# EAGLE design 4x4-keyboard (EAGLE 6.6.0)
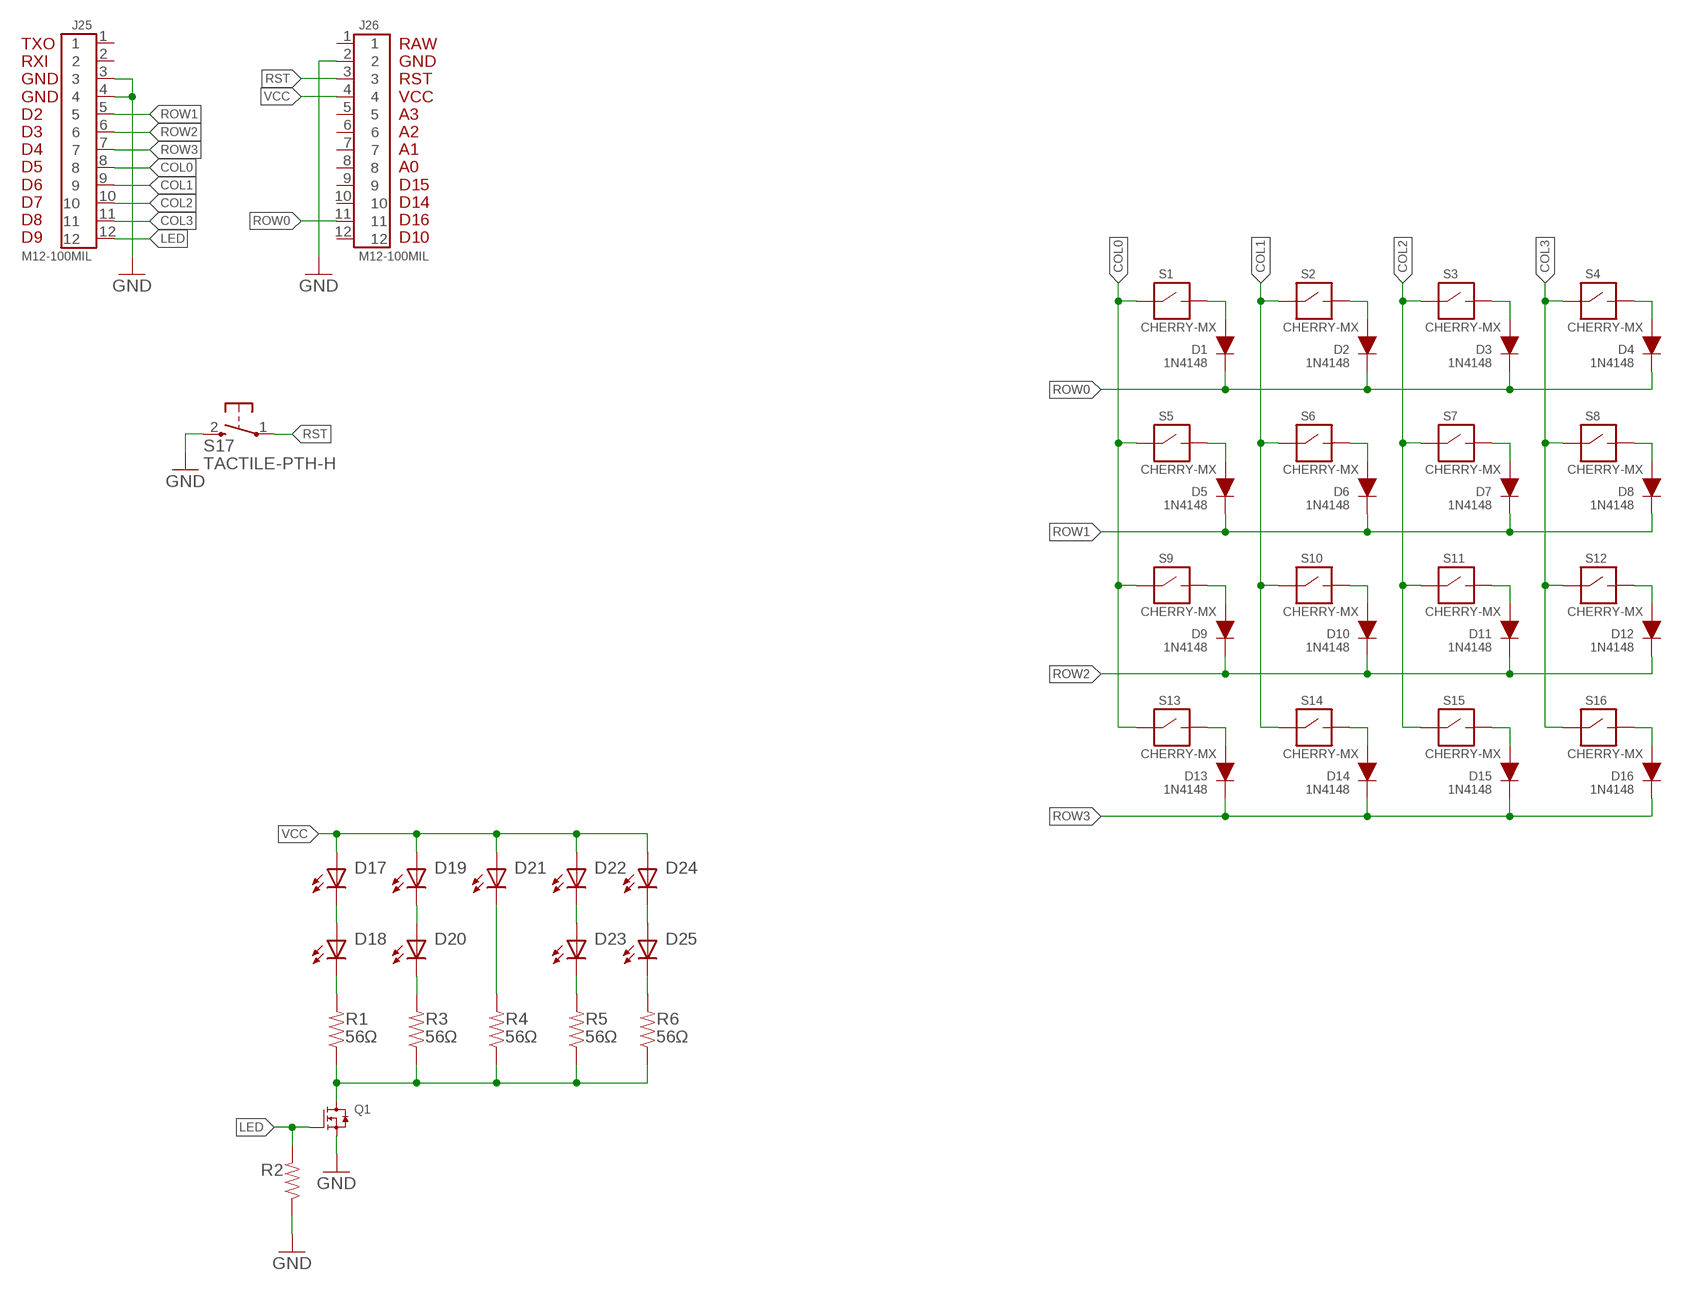
[diagram p0: schematic, sheet 1]

## Parts
D1  1N4148  DIODE-PTH  [DIODE-PTH]
D2  1N4148  DIODE-PTH  [DIODE-PTH]
D3  1N4148  DIODE-PTH  [DIODE-PTH]
D4  1N4148  DIODE-PTH  [DIODE-PTH]
D5  1N4148  DIODE-PTH  [DIODE-PTH]
D6  1N4148  DIODE-PTH  [DIODE-PTH]
D7  1N4148  DIODE-PTH  [DIODE-PTH]
D8  1N4148  DIODE-PTH  [DIODE-PTH]
D9  1N4148  DIODE-PTH  [DIODE-PTH]
D10  1N4148  DIODE-PTH  [DIODE-PTH]
D11  1N4148  DIODE-PTH  [DIODE-PTH]
D12  1N4148  DIODE-PTH  [DIODE-PTH]
D13  1N4148  DIODE-PTH  [DIODE-PTH]
D14  1N4148  DIODE-PTH  [DIODE-PTH]
D15  1N4148  DIODE-PTH  [DIODE-PTH]
D16  1N4148  DIODE-PTH  [DIODE-PTH]
D17  LED-3MM  [3MM-LED]
D18  LED-3MM  [3MM-LED]
D19  LED-3MM  [3MM-LED]
D20  LED-3MM  [3MM-LED]
D21  LED-3MM  [3MM-LED]
D22  LED-3MM  [3MM-LED]
D23  LED-3MM  [3MM-LED]
D24  LED-3MM  [3MM-LED]
D25  LED-3MM  [3MM-LED]
J25  M12-100MIL  [M12X1]
J26  M12-100MIL  [M12X1]
Q1  N-MOSFET-TO-92  [TO-92-3]
R1  56Ω  RESISTOR-PTH  [RESISTOR-PTH]
R2  RESISTOR-PTH  [RESISTOR-PTH]
R3  56Ω  RESISTOR-PTH  [RESISTOR-PTH]
R4  56Ω  RESISTOR-PTH  [RESISTOR-PTH]
R5  56Ω  RESISTOR-PTH  [RESISTOR-PTH]
R6  56Ω  RESISTOR-PTH  [RESISTOR-PTH]
S1  CHERRY-MX  [CHERRY-MX]
S2  CHERRY-MX  [CHERRY-MX]
S3  CHERRY-MX  [CHERRY-MX]
S4  CHERRY-MX  [CHERRY-MX]
S5  CHERRY-MX  [CHERRY-MX]
S6  CHERRY-MX  [CHERRY-MX]
S7  CHERRY-MX  [CHERRY-MX]
S8  CHERRY-MX  [CHERRY-MX]
S9  CHERRY-MX  [CHERRY-MX]
S10  CHERRY-MX  [CHERRY-MX]
S11  CHERRY-MX  [CHERRY-MX]
S12  CHERRY-MX  [CHERRY-MX]
S13  CHERRY-MX  [CHERRY-MX]
S14  CHERRY-MX  [CHERRY-MX]
S15  CHERRY-MX  [CHERRY-MX]
S16  CHERRY-MX  [CHERRY-MX]
S17  TACTILE-PTH-H  [TACTILE-HORIZONTAL]

## Nets
COL0: J25.8 S1.S1 S1.S4(S1) S5.S1 S5.S4(S1) S9.S1 S9.S4(S1) S13.S1 S13.S4(S1)
COL1: J25.9 S2.S1 S2.S4(S1) S6.S1 S6.S4(S1) S10.S1 S10.S4(S1) S14.S1 S14.S4(S1)
COL2: J25.10 S3.S1 S3.S4(S1) S7.S1 S7.S4(S1) S11.S1 S11.S4(S1) S15.S1 S15.S4(S1)
COL3: J25.11 S4.S1 S4.S4(S1) S8.S1 S8.S4(S1) S12.S1 S12.S4(S1) S16.S1 S16.S4(S1)
GND: J25.3 J25.4 J26.2 Q1.1(SOURCE) R2.P$1 S17.2
LED: J25.12 Q1.2(GATE) R2.P$2
N$2: D3.A S3.S2 S3.S3(S2)
N$3: D4.A S4.S2 S4.S3(S2)
N$4: D2.A S2.S2 S2.S3(S2)
N$5: D1.A S1.S2 S1.S3(S2)
N$6: Q1.3(DRAIN) R1.P$1 R3.P$1 R4.P$1 R5.P$1 R6.P$1
N$9: D9.A S9.S2 S9.S3(S2)
N$10: D10.A S10.S2 S10.S3(S2)
N$11: D11.A S11.S2 S11.S3(S2)
N$12: D12.A S12.S2 S12.S3(S2)
N$13: D16.A S16.S2 S16.S3(S2)
N$14: D15.A S15.S2 S15.S3(S2)
N$15: D14.A S14.S2 S14.S3(S2)
N$16: D13.A S13.S2 S13.S3(S2)
N$17: D5.A S5.S2 S5.S3(S2)
N$18: D6.A S6.S2 S6.S3(S2)
N$19: D7.A S7.S2 S7.S3(S2)
N$20: D8.A S8.S2 S8.S3(S2)
N$22: D21.C R4.P$2
N$23: D24.C D25.A
N$24: D22.C D23.A
N$25: D23.C R5.P$2
N$28: D25.C R6.P$2
N$34: D19.C D20.A
N$35: D20.C R3.P$2
N$36: D18.C R1.P$2
N$37: D17.C D18.A
ROW0: D1.C D2.C D3.C D4.C J26.11
ROW1: D5.C D6.C D7.C D8.C J25.5
ROW2: D9.C D10.C D11.C D12.C J25.6
ROW3: D13.C D14.C D15.C D16.C J25.7
RST: J26.3 S17.1
VCC: D17.A D19.A D21.A D22.A D24.A J26.4
Unconnected: J25.1 J25.2 J26.1 J26.5 J26.6 J26.7 J26.8 J26.9 J26.10 J26.12

## Notes on the sheet
- TXO
  RXI
  GND
  GND
  D2
  D3
  D4
  D5
  D6
  D7
  D8
  D9
- RAW
  GND
  RST
  VCC
  A3
  A2
  A1
  A0
  D15
  D14
  D16
  D10

## Library data of the parts
D1-D16 = Passives:DIODE
D17-D25 = Passives:LED
J25 J26 = Connectors:M12
Q1 = Passives:N-MOSFET
R1-R6 = Passives:RESISTOR
S1-S16 = Cherry-MX:CHERRY-MX
S17 = Passives:TACTILE

## Board
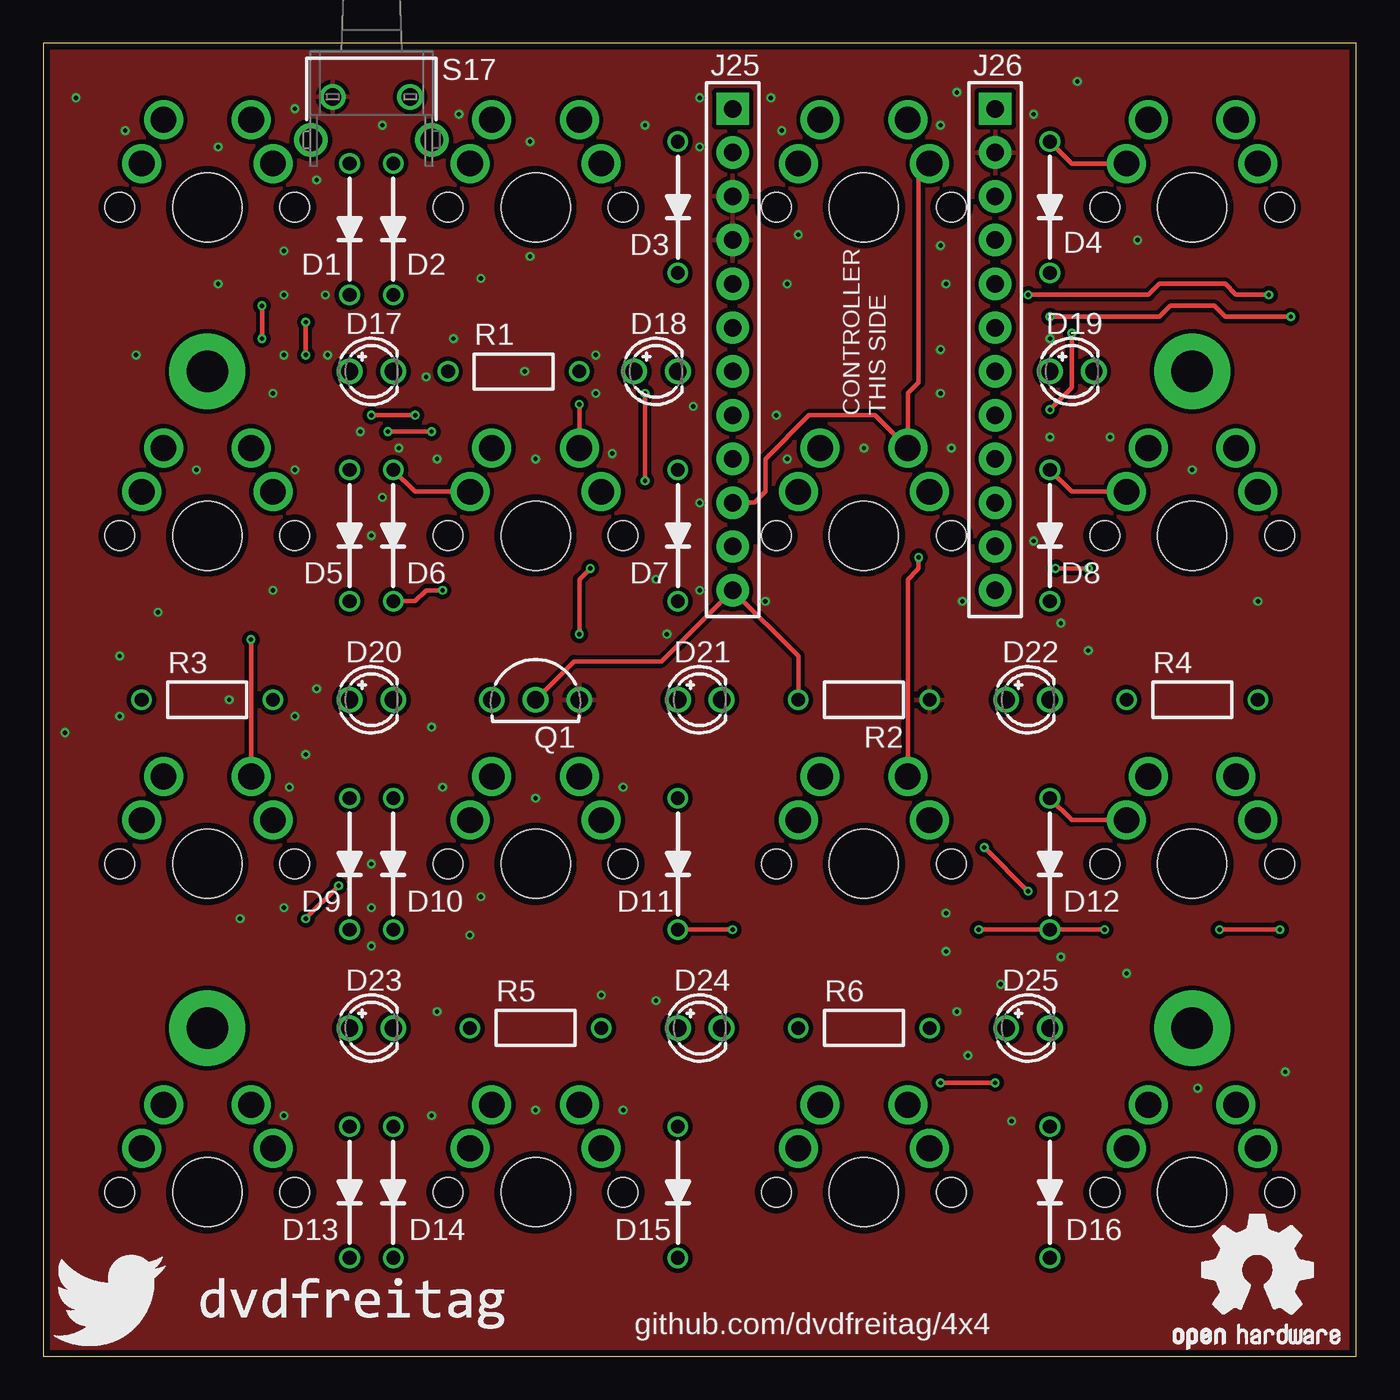
[diagram p1: board, top side]
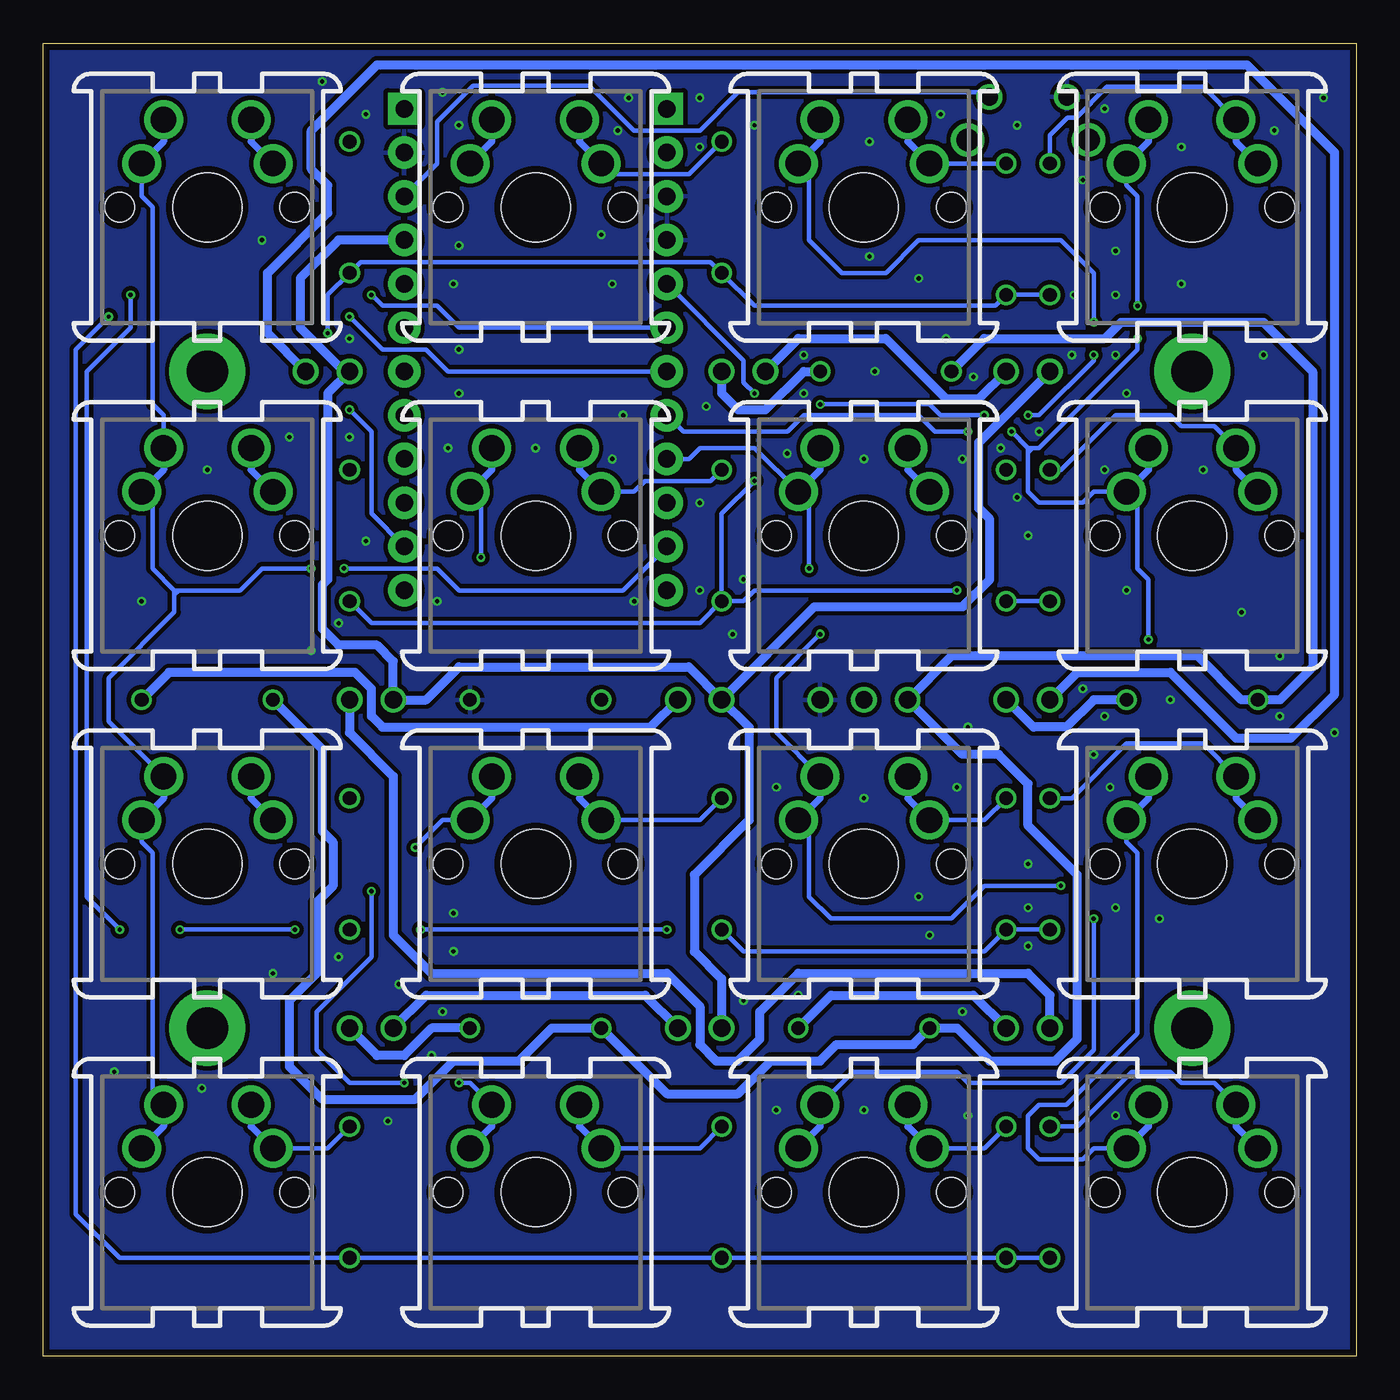
[diagram p2: board, bottom side, seen from below]

Size 76.2 x 76.2 mm. Coordinates in mm from the lower left corner, seen from the top.
Outline: 0,0 76.2,0 76.2,76.2 0,76.2 0,0
Copper layers (1*16): Top 0.035559375mm / dielectric 1.6mm / Bottom 0.035559375mm
Design rules "default *": minimum track width 6mil, minimum drill 10mil, track to track 6mil, track to pad 6mil, pad to pad 6mil, via to via 6mil, smd to smd 6mil, copper to edge 15mil, drill to drill 6mil, minimum pad ring 5mil, minimum via ring 5mil, stop-mask expansion 2.5mil, vias tented up to drill 20mil, thermal gap 10mil

### Footprints (pad centres in the part's own frame; a part is rotated, then mirrored left to right if it is on the bottom)
DIODE-PTH = drill 0.8: A -3.81,0; C 3.81,0
3MM-LED = drill 1: A -1.27,0; C 1.27,0
M12X1 = drill 1.016 pad 1.88 square: 1 0,0 | drill 1.016 pad 1.88: 2 2.54,0; 3 5.08,0; 4 7.62,0; 5 10.16,0; 6 12.7,0; 7 15.24,0; 8 17.78,0; 9 20.32,0; 10 22.86,0; 11 25.4,0; 12 27.94,0
TO-92-3 = drill 1: 1 -2.54,0; 2 0,0; 3 2.54,0
RESISTOR-PTH = drill 0.8: P$1 -3.81,0; P$2 3.81,0
CHERRY-MX = drill 1.499 pad 2.261: S1 -3.81,2.54; S2 2.54,5.08; S3 3.81,2.54; S4 -2.54,5.08 | hole 3.988: 0,0 | hole 1.702: -5.08,0; 5.08,0
TACTILE-HORIZONTAL = drill 0.991: 1 2.616,2.248; 2 2.616,-2.248 | drill 1.295: P$3 5.105,3.505; P$4 5.105,-3.505

### Placement (x,y rotation side)
D1  17.78,65.41 270 top
D2  20.32,65.41 270 top
D3  36.83,66.67 270 top
D4  58.42,66.67 270 top
D5  17.78,47.62 270 top
D6  20.32,47.62 270 top
D7  36.83,47.62 270 top
D8  58.42,47.62 270 top
D9  17.78,28.57 270 top
D10  20.32,28.57 270 top
D11  36.83,28.57 270 top
D12  58.42,28.57 270 top
D13  17.78,9.53 270 top
D14  20.32,9.53 270 top
D15  36.83,9.53 270 top
D16  58.42,9.53 270 top
D17  19.05,57.15 0 top
D18  35.56,57.15 0 top
D19  59.69,57.15 0 top
D20  19.05,38.1 0 top
D21  38.1,38.1 0 top
D22  57.15,38.1 0 top
D23  19.05,19.05 0 top
D24  38.1,19.05 0 top
D25  57.15,19.05 0 top
J25  40.01,72.39 270 top
J26  55.24,72.39 270 top
Q1  28.57,38.1 180 top
R1  27.3,57.15 0 top
R2  47.62,38.1 180 top
R3  9.53,38.1 0 top
R4  66.67,38.1 0 top
R5  28.57,19.05 0 top
R6  47.62,19.05 0 top
S1  9.53,66.67 0 bottom
S2  28.57,66.67 0 bottom
S3  47.62,66.67 0 bottom
S4  66.67,66.67 0 bottom
S5  9.53,47.62 0 bottom
S6  28.57,47.62 0 bottom
S7  47.62,47.62 0 bottom
S8  66.67,47.62 0 bottom
S9  9.53,28.57 0 bottom
S10  28.57,28.57 0 bottom
S11  47.62,28.57 0 bottom
S12  66.67,28.57 0 bottom
S13  9.53,9.53 0 bottom
S14  28.57,9.53 0 bottom
S15  47.62,9.53 0 bottom
S16  66.67,9.53 0 bottom
S17  19.05,75.69 270 top
U$1  [TWITTER]  0.64,0 0 top
U$2  [OSHW]  65.53,0.25 0 top

### Tracks (layer width: path | path; a pad name or v marks a point on that pad's centre or on a via)
COL0  (via drill 0.25)
  Top 0.254: v22.54,53.66 v20,53.66 | S9.S4 v12.06,41.59 | v12.7,60.96 v12.7,59.05
  Bottom 0.254: J25.8 39.05,53.66 33.02,53.66 32.07,54.61 25.4,54.61 24.45,53.66 v22.54,53.66 | v20,53.66 19.05,52.7 | 19.05,52.7 19.05,52.45 | 19.05,52.45 19.05,50.16 18.41,49.53 15.88,49.53 15.24,50.16 S5.S1 12.7,49.53 12.7,45.72 12.06,45.09 v12.06,41.59 | S9.S1 13.34,29.84 12.7,29.21 12.7,18.73 16.83,14.61 18.41,14.61 19.05,13.97 19.05,12.06 18.41,11.43 15.88,11.43 15.24,12.06 S13.S1 | S1.S1 13.34,67.94 12.7,67.31 v12.7,60.96 | v12.7,59.05 12.7,58.42 18.41,52.7 18.8,52.7 | 18.8,52.7 19.05,52.7 | 18.8,52.7 19.05,52.45
  Bottom 0.406: S1.S4 12.06,70.48 S1.S1 | S5.S4 12.06,51.44 S5.S1 | S9.S4 12.06,32.38 S9.S1 | S13.S4 12.06,13.34 S13.S1
COL1  (via drill 0.25)
  Top 0.254: v15.24,25.4 v17.14,27.3 | v31.11,41.91 31.11,45.09 v31.75,45.72 | S6.S4 v31.11,55.24 | v21.59,54.61 v19.05,54.61 | v15.24,58.1 v15.24,60.01
  Bottom 0.254: J25.9 38.73,52.07 38.1,52.7 34.92,52.7 S6.S1 31.75,49.53 v31.75,45.72 | v17.14,27.3 21.59,27.3 23.5,25.4 30.48,25.4 31.75,26.67 31.75,30.48 S10.S1 | v31.11,55.24 24.77,55.24 24.13,54.61 v21.59,54.61 | v19.05,54.61 18.41,54.61 15.24,57.78 v15.24,58.1 | v15.24,60.01 15.24,62.87 17.14,64.77 25.4,64.77 27.3,62.87 29.84,62.87 31.75,64.77 31.75,68.58 S2.S1 | S10.S4 33.66,36.2 33.66,39.37 v31.11,41.91 | S14.S4 29.21,16.51 23.18,16.51 22.54,15.88 17.14,15.88 15.24,17.78 v15.24,25.4
  Bottom 0.406: S2.S4 31.11,70.48 S2.S1 | S6.S4 31.11,51.44 S6.S1 | S10.S4 31.11,32.38 S10.S1 | S14.S4 31.11,13.34 S14.S1
COL2  (via drill 0.25)
  Top 0.254: J25.10 41.27,49.53 41.91,50.16 41.91,52.07 44.45,54.61 48.26,54.61 S7.S4 50.16,55.88 50.8,56.52 50.8,68.58 S3.S1 | v54.61,29.53 v57.15,26.99 | v55.24,15.88 v52.07,15.88 | S11.S4 50.16,45.09 50.8,45.72 v50.8,46.35
  Bottom 0.254: S11.S1 53.02,31.11 v54.61,29.53 | v57.15,26.99 57.15,23.18 60.33,20 60.33,17.78 58.42,15.88 v55.24,15.88 | v52.07,15.88 51.44,15.88 S15.S4 | v50.8,46.35 50.8,49.53 S7.S1
  Bottom 0.406: S7.S4 50.16,51.44 S7.S1 | S3.S4 50.16,70.48 S3.S1 | S11.S4 50.16,32.38 S11.S1 | S15.S4 50.16,13.34 S15.S1
COL3  (via drill 0.25)
  Top 0.254: v58.74,45.72 v60.64,45.72
  Bottom 0.254: S4.S1 70.48,67.31 69.85,66.67 69.85,55.24 69.22,54.61 S8.S4 | J25.11 42.55,44.45 52.07,44.45 53.34,45.72 v58.74,45.72 | v60.64,45.72 63.5,45.72 64.77,44.45 68.33,44.45 | 68.33,44.45 68.58,44.45 | 68.58,44.45 69.85,45.72 69.85,49.53 S8.S1 | 68.58,44.45 68.58,44.2 | S12.S1 70.48,29.84 69.85,29.21 69.85,15.24 S16.S4 | 68.33,44.45 68.58,44.2 | S12.S4 72.39,36.83 72.39,39.37 68.58,43.18 68.58,44.2
  Bottom 0.406: S4.S4 69.22,70.48 S4.S1 | S8.S4 69.22,51.44 S8.S1 | S12.S4 69.22,32.38 S12.S1 | S16.S4 69.22,13.34 S16.S1
GND  (via drill 0.25)
  other vias: 43.18,62.23 52.07,58.42 58.42,59.05 52.07,55.88 52.7,52.7 43.18,52.07 42.55,54.61 47.62,52.7 53.34,43.81 41.91,43.81 38.1,44.45 35.56,45.09 36.2,41.91 59.05,42.55 66.67,51.44 38.1,49.53 33.02,52.39 37.72,55.12 32.07,55.88 22.86,52.07 19.68,49.85 28.57,52.07 14.61,51.44 13.34,55.88 13.97,61.59 16.38,61.59 8.89,51.44 13.34,44.45 19.05,47.62 70.48,43.81 60.64,40.96 32.07,58.1 18.41,53.66 20.64,52.7 16.51,58.1 22.23,56.83 23.81,59.05 27.94,57.15 25.4,62.55 28.26,63.82 10.16,62.23 5.4,58.1 13.97,58.1 6.67,43.18 15.24,34.92 14.61,37.15 15.88,38.73 14.29,33.02 13.97,26.04 11.43,25.4 19.05,28.57 19.05,26.04 19.05,23.81 23.18,33.02 22.54,36.51 28.57,32.38 33.66,33.02 35.56,20.64 28.57,14.29 33.66,14.29 22.54,13.97 13.97,13.97 22.86,20 24.77,24.45 25.4,26.67 53.66,17.46 53.02,20 55.56,21.59 56.2,13.65 62.87,22.23 59.05,23.18 52.39,23.5 52.39,25.72 32.38,20.95 4.45,40.64 4.45,37.15 1.27,36.2 10.79,38.1 57.47,47.31 58.42,53.34 61.91,53.34 63.5,64.77 52.07,64.45 52.39,62.23 43.81,65.09 52.07,71.44 53.02,73.34 57.47,72.07 60.01,73.98 42.86,71.12 42.23,73.03 38.1,70.17 38.1,73.03 34.92,71.44 28.26,70.48 24.13,72.07 19.68,71.44 14.61,72.39 10.16,70.17 15.88,68.26 13.97,64.14 1.91,73.03 4.76,71.12 72.07,16.51 66.99,15.56
  pour Top (isolate 0.254): -1.27,77.47 -1.27,-1.27 77.47,-1.27 77.47,77.47
  pour Bottom (isolate 0.254): -2.54,78.74 -2.54,-2.54 78.74,-2.54 78.74,78.74
LED
  Top 0.254: R2.P$2 43.81,40.64 J25.12 35.88,40.32 30.8,40.32 Q1.2
N$1  (via drill 2.4 pad 4.4)
  other vias: 9.53,57.15
N$2
  Bottom 0.254: S3.S3 43.18,68.58 38.73,68.58 D3.A
  Bottom 0.406: S3.S2 45.09,70.48 S3.S3
N$3
  Top 0.254: S4.S3 59.69,69.22 D4.A
  Bottom 0.406: S4.S2 64.14,70.48 S4.S3
N$4
  Bottom 0.254: S2.S3 D2.A
  Bottom 0.406: S2.S2 26.04,70.48 S2.S3
N$5
  Bottom 0.254: S1.S2 8.89,73.66 14.48,73.66 16.26,71.88 16.76,71.88 17.78,70.87 D1.A
  Bottom 0.406: S1.S2 6.99,70.48 S1.S3
N$6
  Bottom 0.508: R4.P$1 60.01,35.24 60.01,30.48 59.37,29.84 59.37,27.3 60.33,26.35 60.33,22.23 61.91,20.64 61.91,16.83 60.01,14.92 54.61,14.92 52.39,17.14 48.58,17.14 46.67,19.05 R6.P$1 40.01,15.24 35.88,15.24 33.97,17.14 31.11,17.14 30.16,18.1 25.72,18.1 R5.P$1 23.18,19.05 21.27,17.14 17.46,17.14 16.19,18.41 16.19,27.94 19.05,30.8 19.05,33.22 20.76,34.92 22.86,34.92 Q1.3 23.5,40.64 9.21,40.64 6.67,38.1 R3.P$1 4.45,38.1 2.54,40.01 2.54,57.15 5.4,60.01 13.65,60.01 14.61,59.05 21.59,59.05 R1.P$1
N$7  (via drill 2.4 pad 4.4)
  other vias: 66.67,57.15
N$8  (via drill 2.4 pad 4.4)
  other vias: 66.67,19.05
N$9
  Bottom 0.254: D9.A 16.51,32.38 13.34,35.56 8.89,35.56 S9.S2
  Bottom 0.406: S9.S2 6.99,32.38 S9.S3
N$10
  Bottom 0.254: S10.S3 21.59,31.11 D10.A
  Bottom 0.406: S10.S2 26.04,32.38 S10.S3
N$11
  Bottom 0.254: S11.S3 38.1,31.11 D11.A
  Bottom 0.406: S11.S2 45.09,32.38 S11.S3
N$12
  Top 0.254: S12.S3 59.69,31.11 D12.A
  Bottom 0.406: S12.S2 64.14,32.38 S12.S3
N$13
  Bottom 0.254: S16.S3 59.69,12.06 D16.A
  Bottom 0.406: S16.S2 64.14,13.34 S16.S3
N$14
  Bottom 0.254: S15.S3 38.1,12.06 D15.A
  Bottom 0.406: S15.S2 45.09,13.34 S15.S3
N$15
  Bottom 0.254: S14.S3 21.59,12.06 D14.A
  Bottom 0.406: S14.S2 26.04,13.34 S14.S3
N$16
  Bottom 0.254: D13.A 16.19,13.34 13.02,16.51 10.79,16.51 10.16,15.88 8.26,15.88 S13.S2
  Bottom 0.406: S13.S2 6.99,13.34 S13.S3
N$17
  Bottom 0.254: D5.A 17.14,51.44 13.97,54.61 10.79,54.61 10.16,53.98 8.26,53.98 S5.S2
  Bottom 0.406: S5.S2 6.99,51.44 S5.S3
N$18
  Top 0.254: S6.S3 21.59,50.16 D6.A
  Bottom 0.406: S6.S2 26.04,51.44 S6.S3
N$19
  Bottom 0.254: S7.S3 41.91,50.16 41.27,50.8 37.47,50.8 D7.A
  Bottom 0.406: S7.S2 45.09,51.44 S7.S3
N$20
  Top 0.254: S8.S3 59.69,50.16 D8.A
  Bottom 0.406: S8.S2 64.14,51.44 S8.S3
N$21  (via drill 2.4 pad 4.4)
  other vias: 9.53,19.05
N$22
  Bottom 0.508: D21.C 40.96,36.51 56.52,36.51 57.15,37.15 57.15,38.73 58.1,39.69 68.9,39.69 R4.P$2
N$23
  Bottom 0.508: D25.A 53.98,20.95 41.27,20.95 D24.C
N$24
  Bottom 0.508: D23.A 17.78,20.95 19.05,22.23 32.38,22.23 34.61,20 34.61,18.41 35.88,17.14 37.15,17.14 38.1,18.1 38.1,20.32 40.01,22.23 53.66,22.23 55.88,24.45 55.88,33.66 58.42,36.2 D22.C
N$25
  Bottom 0.508: R5.P$2 30.48,20.95 22.23,20.95 D23.C
N$28
  Bottom 0.508: D25.C 56.83,17.46 55.24,17.46 53.66,19.05 R6.P$2
N$34
  Bottom 0.508: D19.C 63.18,59.37 63.18,62.87 59.69,66.36 59.69,67.94 60.64,68.9 60.64,71.12 56.83,74.93 6.35,74.93 1.27,69.85 1.27,38.42 3.81,35.88 6.99,35.88 10.79,39.69 16.19,39.69 D20.A
N$35
  Bottom 0.508: R3.P$2 15.24,38.1 16.83,36.51 18.73,36.51 D20.C
N$36
  Bottom 0.508: D18.C 36.83,55.88 35.88,54.93 34.29,54.93 32.07,57.15 R1.P$2
N$37
  Bottom 0.508: D18.A 32.38,59.05 27.3,59.05 23.81,55.56 21.91,55.56 D17.C
ROW0  (via drill 0.25)
  Top 0.254: v58.42,54.93 59.69,56.2 v59.69,59.37
  Bottom 0.254: D1.C D2.C 20.95,60.96 34.92,60.96 D3.C 37.47,63.5 57.78,63.5 D4.C 59.69,61.59 v59.69,59.37 | J26.11 57.15,48.9 57.15,53.66 v58.42,54.93
ROW1  (via drill 0.25)
  Top 0.254: v23.18,44.45 22.23,44.45 21.59,43.81 D6.C | v34.92,50.8 v34.92,55.88
  Bottom 0.254: D8.C 57.15,42.55 38.1,42.55 D7.C | D7.C 35.56,43.81 34.92,44.45 v23.18,44.45 | D6.C D5.C | D7.C 36.83,48.9 v34.92,50.8 | v34.92,55.88 35.56,56.52 35.56,57.78 J25.5
ROW2  (via drill 0.25)
  Top 0.254: v54.29,24.77 D12.C v61.59,24.77 | v40.01,24.77 D11.C | v57.15,61.59 64.14,61.59 64.77,62.23 68.58,62.23 69.22,61.59 v71.12,61.59 | v71.75,24.77 v68.26,24.77
  Bottom 0.254: v54.29,24.77 v40.01,24.77 | D11.C 35.56,23.5 21.59,23.5 D10.C D9.C | J25.6 52.07,59.69 53.34,60.96 56.52,60.96 v57.15,61.59 | v71.12,61.59 71.12,59.69 73.66,57.15 73.66,26.67 v71.75,24.77 | v68.26,24.77 v61.59,24.77
ROW3  (via drill 0.25)
  Top 0.254: v58.42,60.33 64.77,60.33 65.41,60.96 67.94,60.96 68.58,60.33 v72.39,60.33
  Bottom 0.254: D13.C D14.C D15.C D16.C 71.75,5.71 74.3,8.26 74.3,58.42 v72.39,60.33 | J25.7 52.7,57.15 53.98,58.42 56.52,58.42 v58.42,60.33
RST
  Bottom 0.254: J26.3 53.34,69.22 53.34,71.63 51.24,73.72 44.51,73.72 41.91,71.12 38.1,71.12 35.88,73.34 21.57,73.34 S17.1
VCC
  Bottom 0.508: J26.4 59.05,64.77 61.28,62.55 61.28,59.69 58.74,57.15 D19.A 59.69,55.88 59.69,45.09 60.01,44.77 60.01,42.23 59.05,41.27 56.83,41.27 55.88,40.32 D22.A 53.98,38.1 52.07,40.01 38.73,40.01 D21.A | D21.A 31.43,43.5 22.86,43.5 21.27,45.09 21.27,48.58 21.91,49.21 21.91,53.02 D17.A | D21.A 35.24,36.51 35.24,31.11 38.42,27.94 38.42,23.5 36.83,21.91 D24.A

### Text on the board
tPlace: CONTROLLER / THIS SIDE | github.com/dvdfreitag/4x4